# EAGLE design IMD_AMS_Latch (EAGLE 9.2.2)
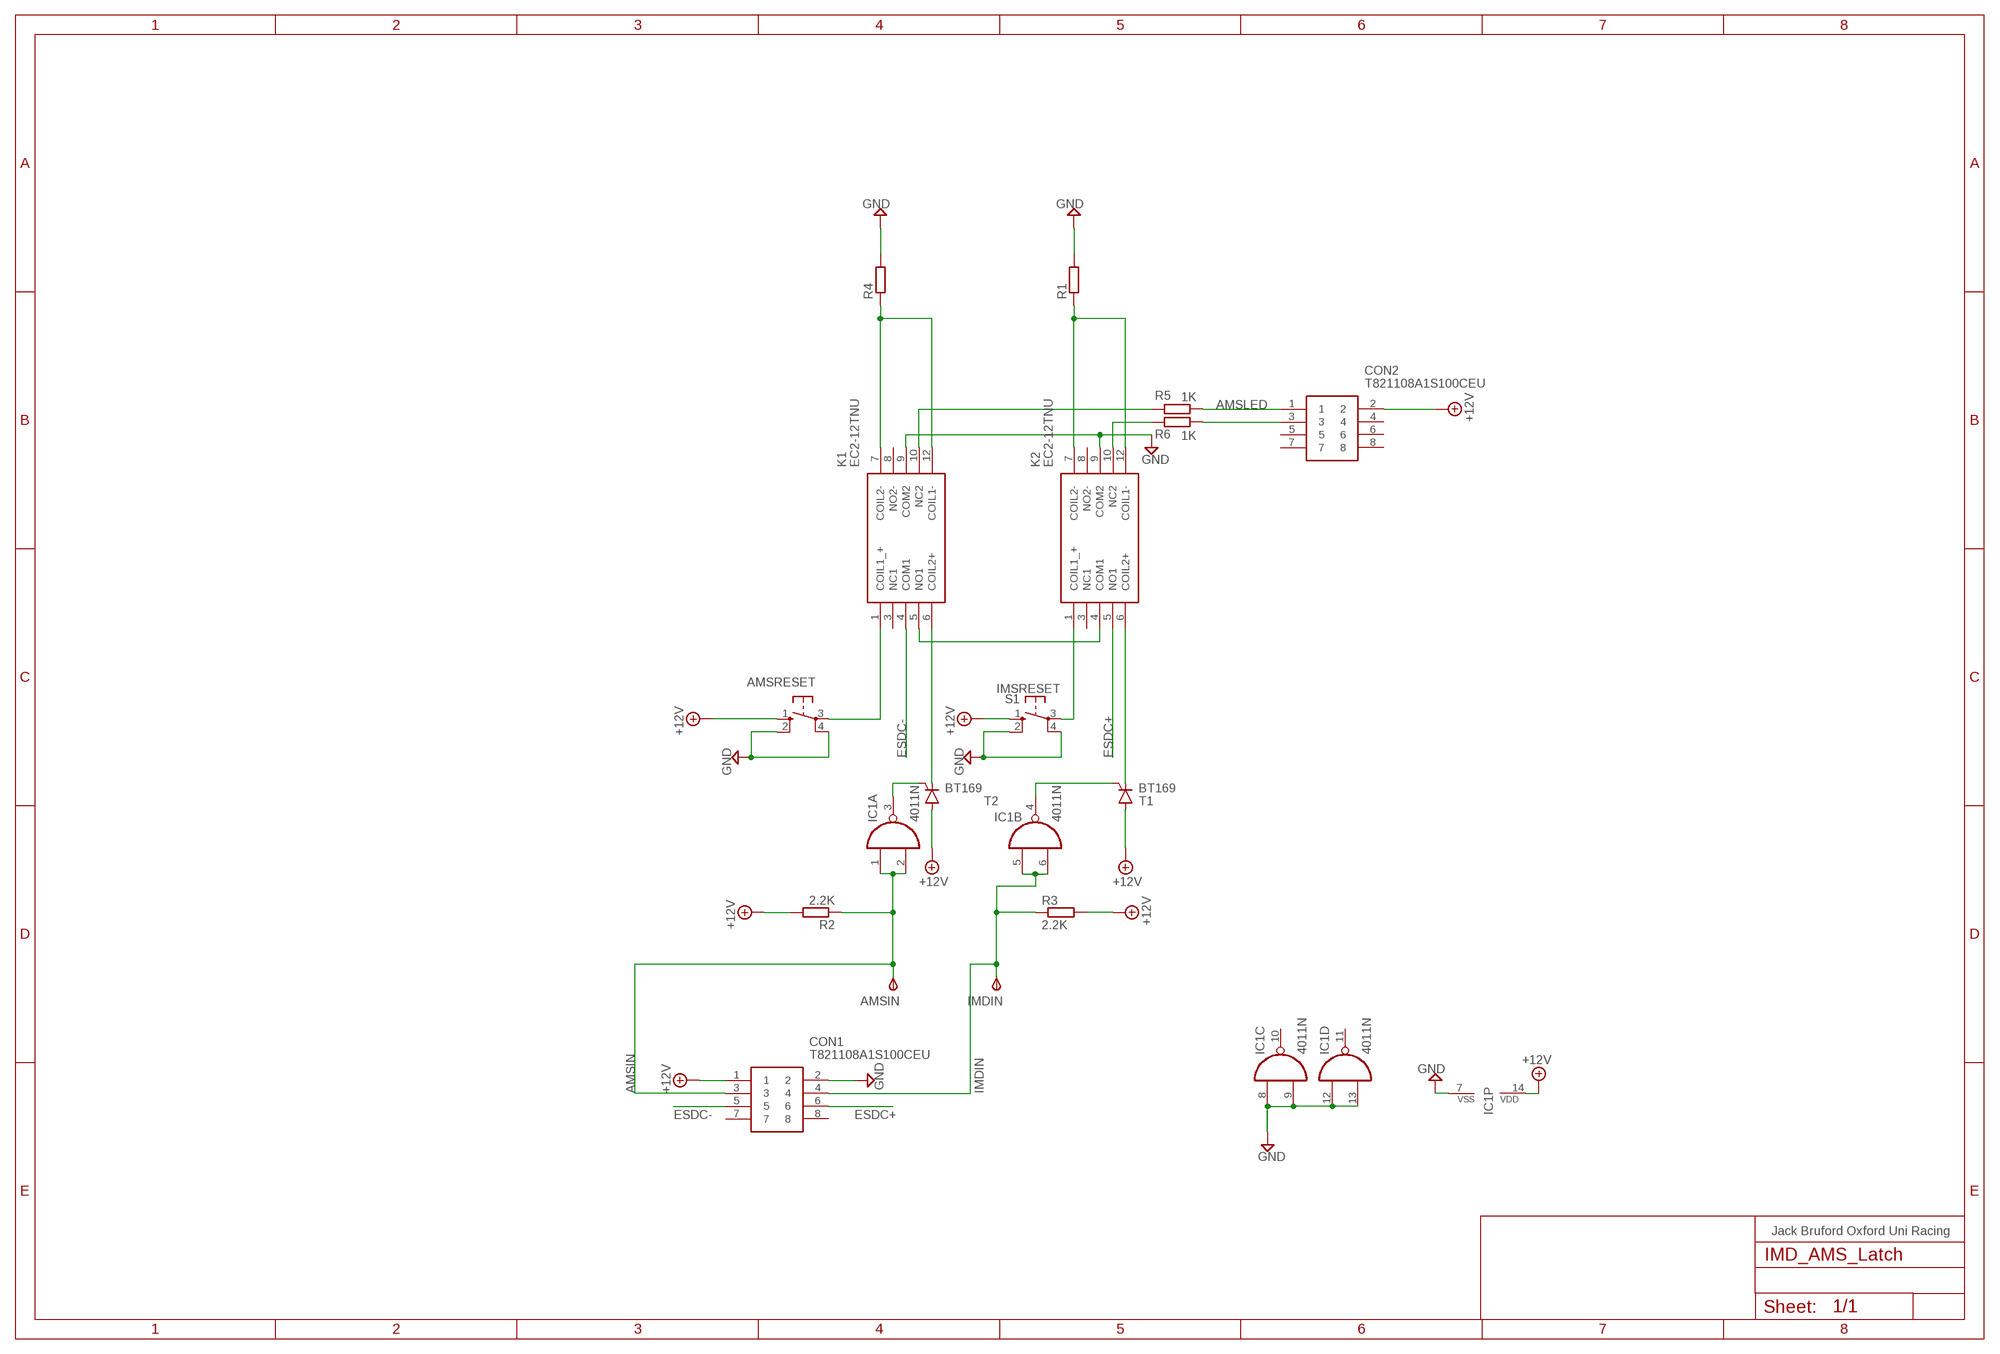
[diagram p0: schematic, sheet 1]

## Parts
AMSIN  TPSPAD1-13  [P1-13]
AMSRESET  10-XX  [B3F-10XX]
CON1  T821108A1S100CEU  [HDRV8W64P254_2X4_1778X895X915P]
CON2  T821108A1S100CEU  [HDRV8W64P254_2X4_1778X895X915P]
IC1  4011N  [DIL14]
IMDIN  TPSPAD1-13  [P1-13]
K1  EC2-12TNU  [EC212TNU]
K2  EC2-12TNU  [EC212TNU]
R1  R-EU_0207/15  [0207/15]
R2  2.2K  R-EU_0207/15  [0207/15]
R3  2.2K  R-EU_0207/15  [0207/15]
R4  R-EU_0207/15  [0207/15]
R5  1K  R-EU_0207/15  [0207/15]
R6  1K  R-EU_0207/15  [0207/15]
S1  10-XX  [B3F-10XX]
T1  BT169  [TO92-2]
T2  BT169  [TO92-2]

## Nets
+12V: AMSRESET.1(S) CON1.1 CON2.2 IC1.14(P:VDD) R2.2 R3.2 S1.1(S) T1.A T2.A
AMSIN: AMSIN.TP(PP) CON1.3 IC1.1(A:I0) IC1.2(A:I1) R2.1
AMSLED: K1.10(NC2) R5.2
ESDC+: CON1.6 K2.5(NO1)
ESDC-: CON1.5 K1.4(COM1)
GND: AMSRESET.2(S1) AMSRESET.4(P1) CON1.2 IC1.7(P:VSS) IC1.8(C:I0) IC1.9(C:I1) IC1.12(D:I0) IC1.13(D:I1) K1.9(COM2) K2.9(COM2) R1.2 R4.2 S1.2(S1) S1.4(P1)
IMDIN: CON1.4 IC1.5(B:I0) IC1.6(B:I1) IMDIN.TP(PP) R3.1
IMSRESET: K1.5(NO1) K2.4(COM1)
N$1: AMSRESET.3(P) K1.1(COIL1_+)
N$2: K1.6(COIL2+) T2.C
N$3: K2.7(COIL2-) K2.12(COIL1-) R1.1
N$4: K2.6(COIL2+) T1.C
N$5: K2.1(COIL1_+) S1.3(P)
N$6: K1.7(COIL2-) K1.12(COIL1-) R4.1
N$7: K2.10(NC2) R6.2
N$8: CON2.1 R5.1
N$9: CON2.3 R6.1
N$10: IC1.3(A:O) T2.G
N$11: IC1.4(B:O) T1.G
Unconnected: CON1.7 CON1.8 CON2.4 CON2.5 CON2.6 CON2.7 CON2.8 IC1.10(C:O) IC1.11(D:O) K1.3(NC1) K1.8(NO2-) K2.3(NC1) K2.8(NO2-)

## Notes on the sheet
- Jack Bruford Oxford Uni Racing

## Library data of the parts
AMSIN IMDIN = testpad:TPS: TEST PIN
AMSRESET S1 = switch-omron:10-XX: OMRON SWITCH; MPN: B3F-1000; OC_FARNELL: 176432; OC_NEWARK: 36M3542
CON1 CON2 = T821108A1S100CEU:T821108A1S100CEU: HEADER, VERTICAL, 2.54MM, 8WAY Amphenol T821 Series, 2.54mm Pitch 8 Way 2 Row Straight PCB Header, Solder Termination, 3A Source: Datasheet <http://uk.rs-online.com/web/p/products/1702738>; DESCRIPTION: HEADER, VERTICAL, 2.54MM, 8WAY Amphenol T821 Series, 2.54mm Pitch 8 Way 2 Row Straight PCB Header, Solder Termination, 3A; HEIGHT: 9.15mm; MANUFACTURER_NAME: Amphenol; MANUFACTURER_PART_NUMBER: T821108A1S100CEU; RS_PART_NUMBER: 1702738
IC1 = 40xx:4011: Quad 2-input NAND
K1 K2 = SamacSys_Parts:EC2-12TNU: DPDT Through Hole Latching Relay, 2 A, 12V dc Source: Datasheet <https://componentsearchengine.com/Datasheets/1/EC2-12TNU.pdf>; DESCRIPTION: DPDT Through Hole Latching Relay, 2 A, 12V dc; HEIGHT: 9mm; MANUFACTURER_NAME: Kemet; MANUFACTURER_PART_NUMBER: EC2-12TNU; MOUSER_PART_NUMBER: 80-EC2-12TNU
R1-R6 = rcl:R-EU_: RESISTOR, European symbol; SPICEPREFIX: R
T1 T2 = triac:BT169: THYRISTOR

## Board
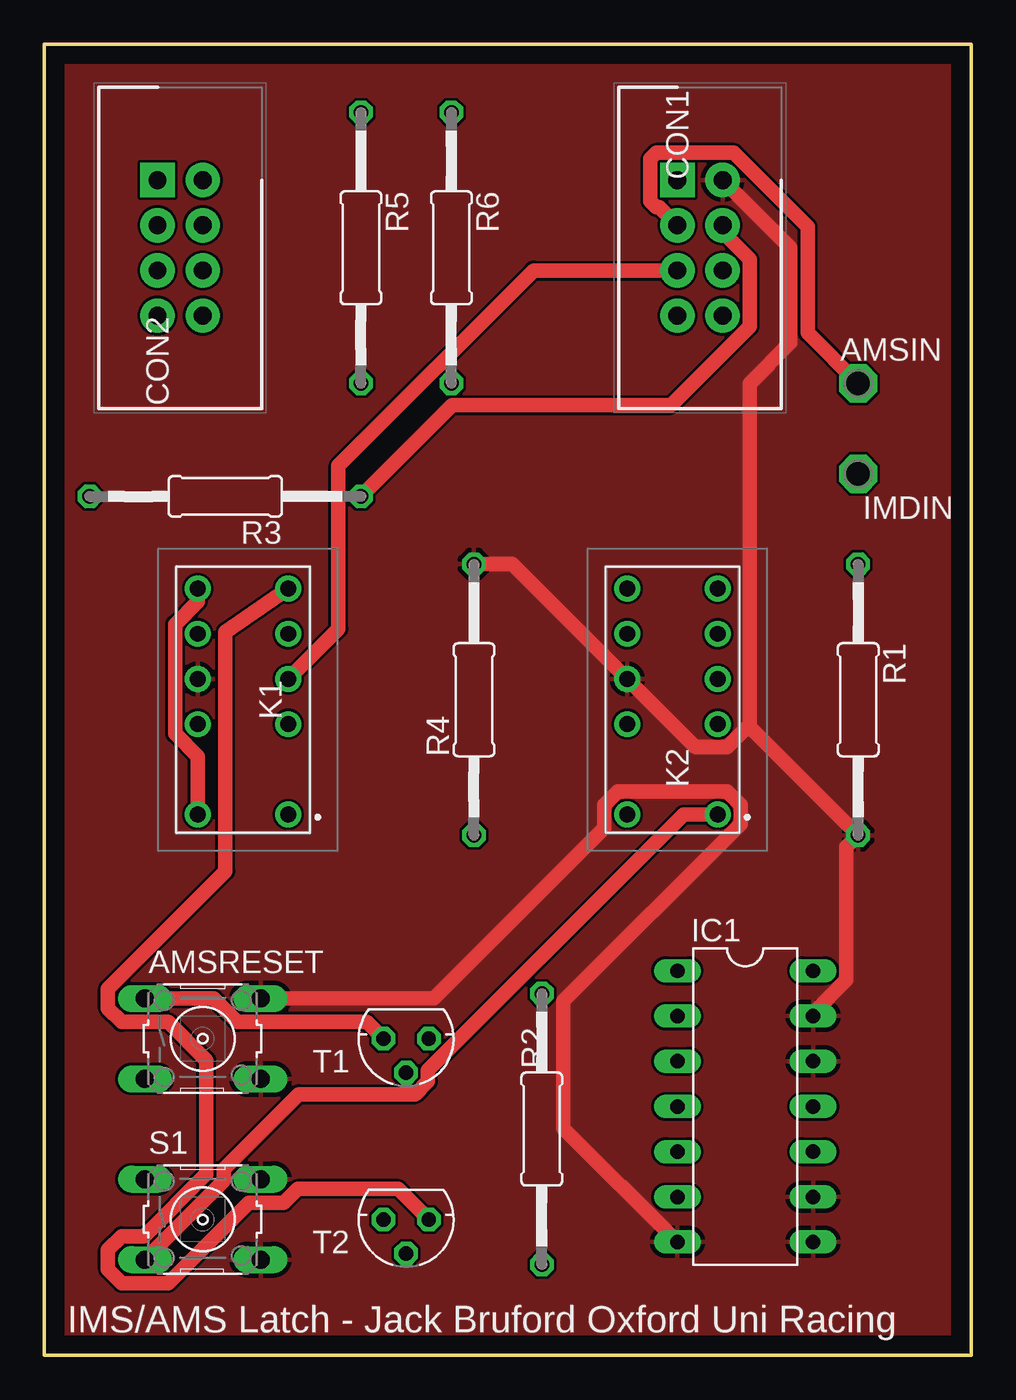
[diagram p1: board, top side]
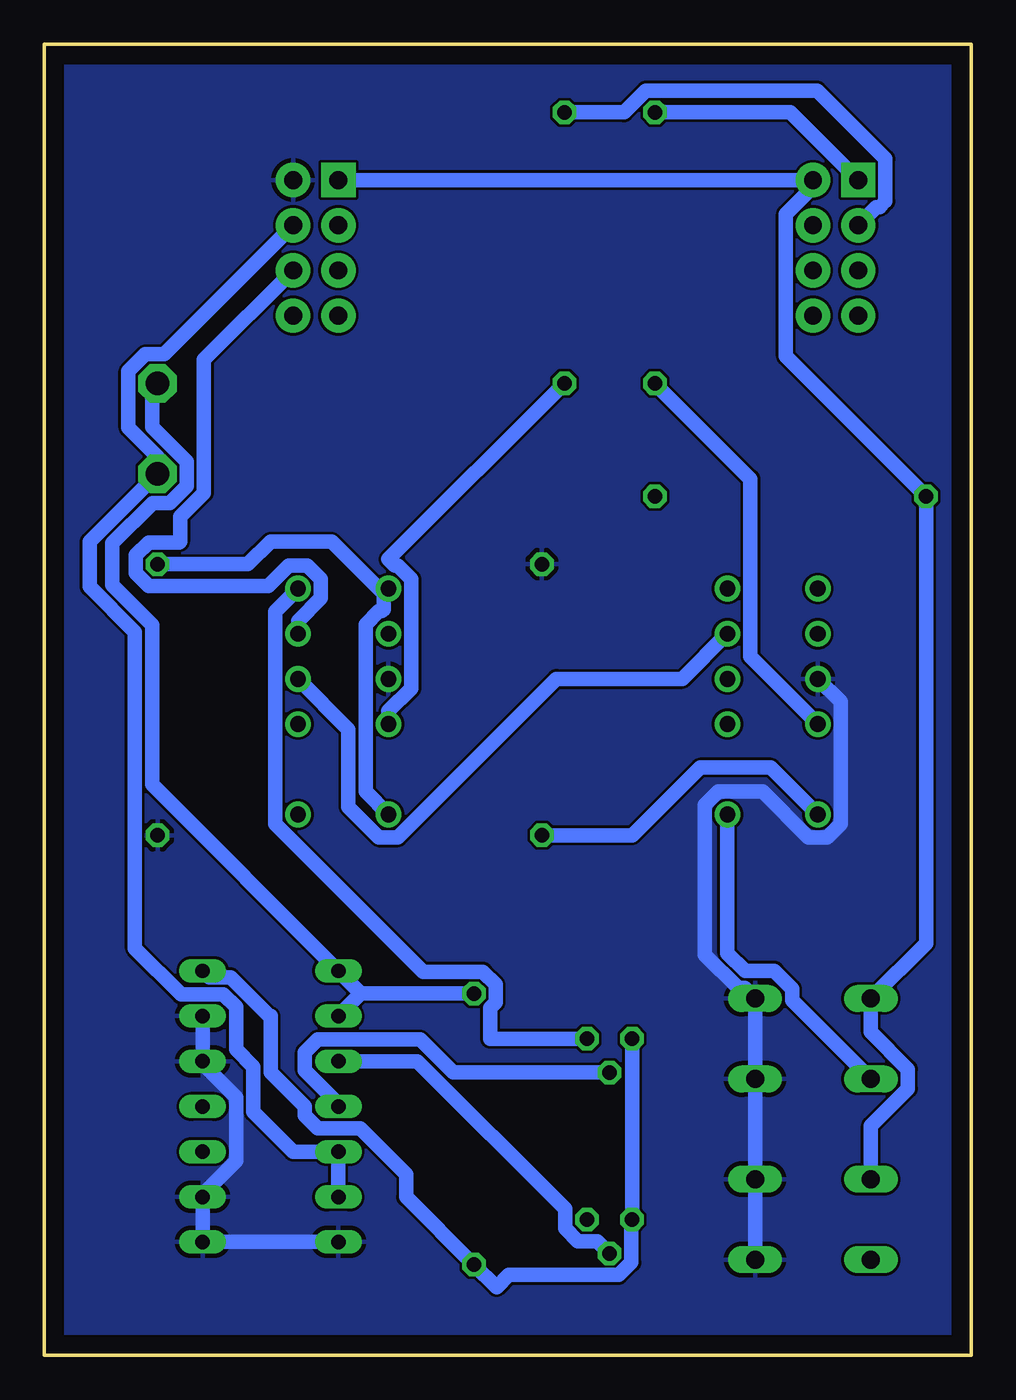
[diagram p2: board, bottom side, seen from below]

Size 52.07 x 73.66 mm. Coordinates in mm from the lower left corner, seen from the top.
Outline: 0,0 52.07,0 52.07,73.66 0,73.66 0,0
Copper layers (1*16): Top 0.035mm / dielectric 1.5mm / Bottom 0.035mm
Design rules "default": minimum track width 6mil, minimum drill 0.35mm, track to track 6mil, track to pad 6mil, pad to pad 6mil, via to via 6mil, smd to smd 6mil, copper to edge 40mil, drill to drill 6mil, minimum pad ring 10mil, minimum via ring 8mil, stop-mask expansion 4mil, vias tented up to drill 0mil, thermal gap 10mil

### Footprints (pad centres in the part's own frame; a part is rotated, then mirrored left to right if it is on the bottom)
P1-13 = drill 1.321 pad 2.159 octagon: TP 0,0
B3F-10XX = drill 1.016 long: 1 -3.251,2.261; 2 3.251,2.261; 3 -3.251,-2.261; 4 3.251,-2.261
HDRV8W64P254_2X4_1778X895X915P = drill 1 pad 1.93 square: 1 0,0 | drill 1 pad 1.93: 2 0,2.54; 3 2.54,0; 4 2.54,2.54; 5 5.08,0; 6 5.08,2.54; 7 7.62,0; 8 7.62,2.54
DIL14 = drill 0.813 long: 1 -7.62,-3.81; 2 -5.08,-3.81; 3 -2.54,-3.81; 4 0,-3.81; 5 2.54,-3.81; 6 5.08,-3.81; 7 7.62,-3.81; 8 7.62,3.81; 9 5.08,3.81; 10 2.54,3.81; 11 0,3.81; 12 -2.54,3.81; 13 -5.08,3.81; 14 -7.62,3.81
EC212TNU = drill 0.89 pad 1.446: 1 -6.45,-2.265; 3 -1.37,-2.265; 4 1.17,-2.265; 5 3.71,-2.265; 6 6.25,-2.265; 7 6.25,2.815; 8 3.71,2.815; 9 1.17,2.815; 10 -1.37,2.815; 12 -6.45,2.815
0207/15 = drill 0.813 octagon: 1 -7.62,0; 2 7.62,0
TO92-2 = drill 0.813 octagon: A 1.27,0; C -1.27,0; G 0,1.905

### Placement (x,y rotation side)
AMSIN  45.72,54.61 0 top
AMSRESET  8.89,17.78 0 top
CON1  35.56,66.04 270 top
CON2  6.35,66.04 270 top
IC1  39.37,13.97 270 top
IMDIN  45.72,49.53 0 top
K1  11.43,36.83 90 top
K2  35.56,36.83 90 top
R1  45.72,36.83 270 top
R2  27.94,12.7 270 top
R3  10.16,48.26 180 top
R4  24.13,36.83 90 top
R5  17.78,62.23 270 top
R6  22.86,62.23 270 top
S1  8.89,7.62 0 top
T1  20.32,17.78 180 top
T2  20.32,7.62 180 top

### Tracks (layer width: path | path; a pad name or v marks a point on that pad's centre or on a via)
+12V
  Top 0.813: T1.A 18.11,18.72 10.83,18.72 9.51,20.04 AMSRESET.1
  Bottom 0.813: IC1.14 42.82,21.23 41.62,21.23 39.4,19.02 39.37,19.05 39.37,15.9 37.44,13.97 37.44,13.46 36.73,12.75 34.34,12.75 31.75,10.16 31.75,8.89 R2.2 26.67,3.81 25.98,4.5 19.82,4.5 19.1,5.21 19.1,7.57 T2.A T1.A | S1.1 5.64,12.89 3.56,14.97 3.56,16.07 5.64,18.15 AMSRESET.1 2.54,23.14 R3.2 10.41,56.13 10.41,64.13 8.89,65.66 CON2.2 CON1.1
AMSIN
  Top 0.813: AMSIN.TP 42.88,57.45 42.88,63.42 38.73,67.56 34.36,67.56 34.04,67.24 34.04,64.84 34.36,64.52 34.54,64.52 CON1.3
  Bottom 0.813: R2.1 34.29,20.32 | 34.29,20.32 IC1.2 | 34.29,20.32 IC1.1 46.02,32.05 46.02,41.04 48.26,43.27 48.26,45.62 45.99,47.89 45.04,47.89 44.08,48.85 44.08,50.21 46.02,52.15 46.02,54.3 AMSIN.TP
AMSLED
  Bottom 0.813: K1.10 12.41,39.26 12.41,49.24 R5.2
ESDC+
  Bottom 0.813: CON1.6 43.12,55.94 43.12,48.45 44.45,47.12 44.45,45.72 44.5,45.67 46.23,45.67 46.94,44.95 46.94,43.95 46.23,43.23 39.49,43.23 38.36,44.36 37.29,44.36 36.54,43.61 36.54,42.55 37.83,41.27 K2.5
ESDC-
  Top 0.813: K1.4 16.51,40.81 16.51,49.98 27.49,60.96 CON1.5
GND
  Top 0.813: IC1.13 43.18,19.2 45.06,21.09 45.06,28.55 R1.2 39.62,35.31 | R4.2 26.3,44.45 K2.9 36.57,34.18 38.36,34.18 39.48,35.31 39.62,35.31 | CON1.2 41.91,62.23 41.91,56.9 39.62,54.61 39.62,35.31 | AMSRESET.2 21.87,20.04 31.46,29.63 31.46,30.91 32.21,31.66 38.36,31.66 39.11,30.91 39.11,29.85 29.16,19.9 29.16,12.75 IC1.7
  Bottom 0.813: IC1.7 IC1.8 IC1.9 43.18,9.04 41.3,10.93 41.3,14.47 43.18,16.36 IC1.12 IC1.13 | S1.4 S1.2 AMSRESET.4 AMSRESET.2 12.72,20.62 13.1,20.62 14.98,22.5 14.98,30.91 14.23,31.66 11.71,31.66 9.15,29.1 8.08,29.1 7.33,29.85 7.33,36.72 K1.9
  pour Bottom: 0,0 52.07,0 52.07,1.27 52.07,73.66 0,73.66 0,69.85
  pour Top: 0,0 52.07,0 52.07,73.66 0,73.66
IMDIN
  Top 0.813: R3.1 22.91,53.39 35.23,53.39 39.62,57.79 39.62,61.59 38.1,63.12 CON1.4
  Bottom 0.813: IC1.6 IC1.5 38.1,11.43 40.34,13.66 40.34,16.2 41.3,17.17 41.3,19.55 42.02,20.27 44.4,20.27 46.99,22.86 46.99,40.64 49.53,43.18 49.53,45.72 IMDIN.TP 45.72,50.48 47.36,52.12 47.36,55.29 46.4,56.25 45.35,56.25 CON1.4
IMSRESET
  Bottom 0.813: K1.5 16.23,38 23.31,38 32.21,29.1 33.28,29.1 34.99,30.81 34.99,35.17 K2.4
N$1
  Bottom 0.813: AMSRESET.3 10.06,19.94 10.06,20.59 11.06,21.59 12.7,21.59 13.7,22.59 K1.1
N$2
  Top 0.813: T2.C 19.88,9.33 14.22,9.33 13.45,8.56 11.47,8.56 6.95,4.04 4.33,4.04 3.56,4.81 3.56,5.91 4.33,6.68 5.59,6.68 9.09,10.18 9.09,16.57 6.95,18.72 4.33,18.72 3.56,19.49 3.56,20.59 10.16,27.19 10.16,40.64 K1.6
N$3
  Bottom 0.813: K2.12 34.03,31.66 34.03,41.07 33.28,41.82 33.11,41.82 33.02,41.91 33.02,42.8 | 33.02,42.8 K2.7 | R1.1 40.64,44.45 39.37,45.72 35.94,45.72 33.02,42.8
N$4
  Bottom 0.813: K2.6 39.11,41.8 39.11,29.85 30.8,21.54 27.43,21.54 26.72,20.82 26.72,19.82 27.04,19.5 27.04,17.78 T1.C
N$5
  Top 0.813: S1.3 10.06,9.78 10.06,10.43 14.29,14.66 20.82,14.66 21.54,15.37 21.54,16 35.91,30.38 K2.1
N$6
  Top 0.813: K1.12 8.62,33.65 7.33,34.93 7.33,41.07 8.62,42.35 K1.7
  Bottom 0.813: K1.12 11.26,33.02 15.24,33.02 19.05,29.21 R4.1
N$7
  Bottom 0.813: R6.2 32.74,44.73 32.38,44.36 32.21,44.36 31.46,43.61 31.46,37.47 32.74,36.19 K2.10
N$8
  Bottom 0.813: CON2.1 10.16,69.85 R5.1
N$9
  Bottom 0.813: CON2.3 5.33,64.52 5.15,64.52 4.83,64.84 4.83,67.24 8.66,71.07 18.29,71.07 19.5,69.85 R6.1
N$10
  Bottom 0.813: IC1.3 31.11,16.51 22.81,8.2 22.81,7.12 22.09,6.4 21.01,6.4 T2.G
N$11
  Bottom 0.813: T1.G 29.11,15.88 30.97,17.73 36.73,17.73 37.44,17.02 37.44,16 35.56,14.12 IC1.4

### Text on the board
tNames: IMS/AMS Latch - Jack Bruford Oxford Uni Racing